# EAGLE design side_panel (EAGLE 9.7.0)
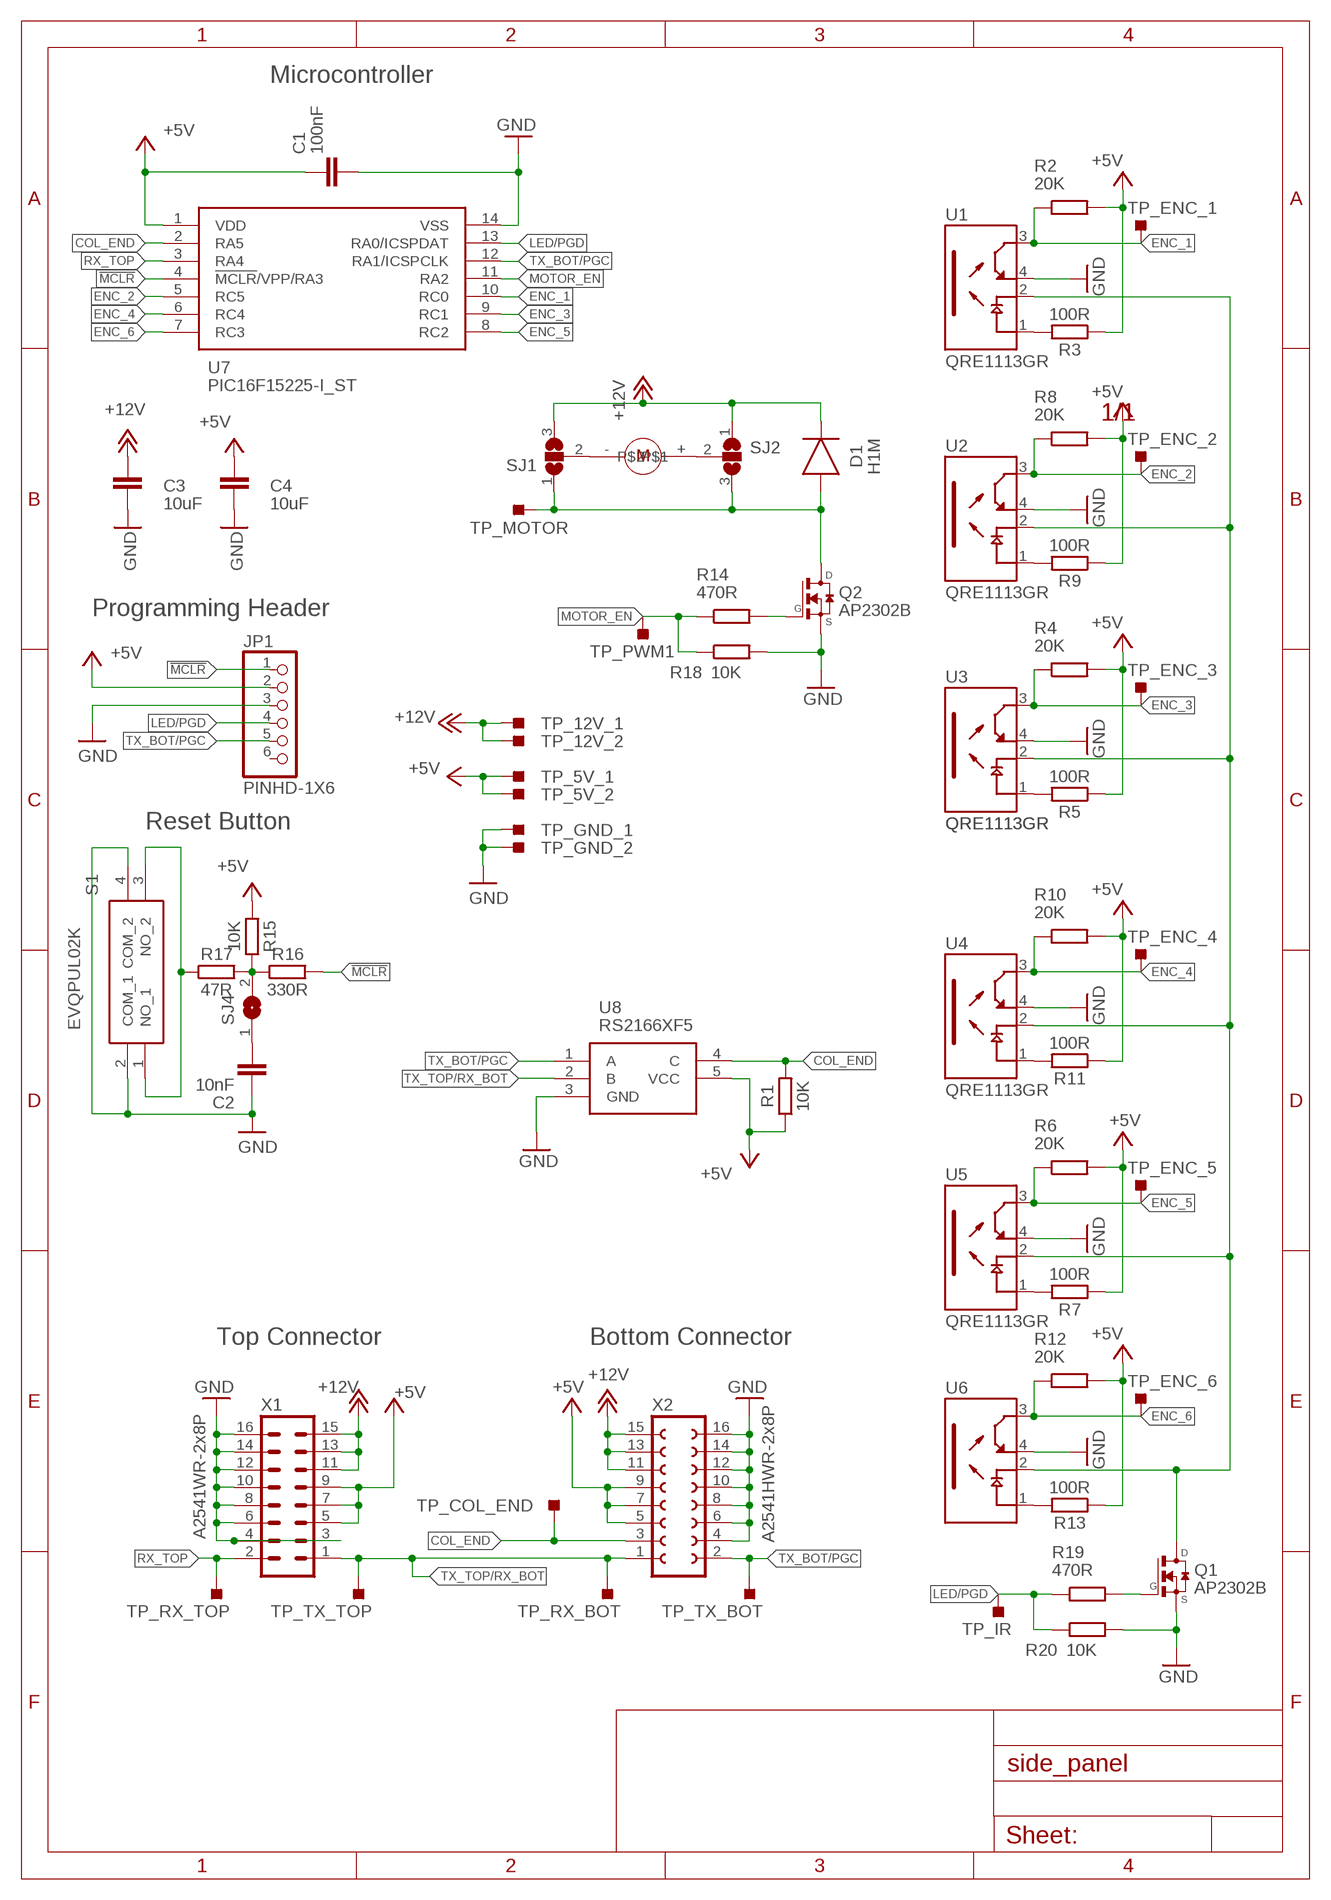
[diagram p0: schematic, sheet 1]

## Parts
C1  100nF  C_CHIP-0805(2012-METRIC)  [CAPC2012X110]
C2  10nF  C_CHIP-0805(2012-METRIC)  [CAPC2012X110]
C3  10uF  C-EUC0805  [C0805]
C4  10uF  C-EUC0805  [C0805]
D1  H1M  DIODE_DO-219-AB(SOD123F)  [SODFL3718X115]
JP1  PINHD-1X6  [1X06]
M1  GA12-N20  [GA12-N20]
Q1  AP2302B  TRANSISTOR-FET_DMN2004K  [TRANSISTOR-FET_SOT23]
Q2  AP2302B  TRANSISTOR-FET_DMN2004K  [TRANSISTOR-FET_SOT23]
R1  10K  R_CHIP-0805(2012-METRIC)  [RESC2012X65]
R2  20K  R_CHIP-0805(2012-METRIC)  [RESC2012X65]
R3  100R  R_CHIP-0805(2012-METRIC)  [RESC2012X65]
R4  20K  R_CHIP-0805(2012-METRIC)  [RESC2012X65]
R5  100R  R_CHIP-0805(2012-METRIC)  [RESC2012X65]
R6  20K  R_CHIP-0805(2012-METRIC)  [RESC2012X65]
R7  100R  R_CHIP-0805(2012-METRIC)  [RESC2012X65]
R8  20K  R_CHIP-0805(2012-METRIC)  [RESC2012X65]
R9  100R  R_CHIP-0805(2012-METRIC)  [RESC2012X65]
R10  20K  R_CHIP-0805(2012-METRIC)  [RESC2012X65]
R11  100R  R_CHIP-0805(2012-METRIC)  [RESC2012X65]
R12  20K  R_CHIP-0805(2012-METRIC)  [RESC2012X65]
R13  100R  R_CHIP-0805(2012-METRIC)  [RESC2012X65]
R14  470R  R_CHIP-0805(2012-METRIC)  [RESC2012X65]
R15  10K  R_CHIP-0805(2012-METRIC)  [RESC2012X65]
R16  330R  R_CHIP-0805(2012-METRIC)  [RESC2012X65]
R17  47R  R_CHIP-0805(2012-METRIC)  [RESC2012X65]
R18  10K  R_CHIP-0805(2012-METRIC)  [RESC2012X65]
R19  470R  R_CHIP-0805(2012-METRIC)  [RESC2012X65]
R20  10K  R_CHIP-0805(2012-METRIC)  [RESC2012X65]
S1  EVQPUL02K  [EVQPUL02K]
SJ1  SJ2W  [SJ_2]
SJ2  SJ2W  [SJ_2]
SJ4  SJ  [SJ]
TP_5V_1  TESTPOINT_TPS-PAD-036  [TESTPOINT_PAD-036]
TP_5V_2  TESTPOINT_TPS-PAD-036  [TESTPOINT_PAD-036]
TP_12V_1  TESTPOINT_TPS-PAD-036  [TESTPOINT_PAD-036]
TP_12V_2  TESTPOINT_TPS-PAD-036  [TESTPOINT_PAD-036]
TP_COL_END  TESTPOINT_TPS-PAD-036  [TESTPOINT_PAD-036]
TP_ENC_1  TESTPOINT_TPS-PAD-036  [TESTPOINT_PAD-036]
TP_ENC_2  TESTPOINT_TPS-PAD-036  [TESTPOINT_PAD-036]
TP_ENC_3  TESTPOINT_TPS-PAD-036  [TESTPOINT_PAD-036]
TP_ENC_4  TESTPOINT_TPS-PAD-036  [TESTPOINT_PAD-036]
TP_ENC_5  TESTPOINT_TPS-PAD-036  [TESTPOINT_PAD-036]
TP_ENC_6  TESTPOINT_TPS-PAD-036  [TESTPOINT_PAD-036]
TP_GND_1  TESTPOINT_TPS-PAD-036  [TESTPOINT_PAD-036]
TP_GND_2  TESTPOINT_TPS-PAD-036  [TESTPOINT_PAD-036]
TP_IR  TESTPOINT_TPS-PAD-036  [TESTPOINT_PAD-036]
TP_MOTOR  TESTPOINT_TPS-PAD-036  [TESTPOINT_PAD-036]
TP_PWM1  TESTPOINT_TPS-PAD-036  [TESTPOINT_PAD-036]
TP_RX_BOT  TESTPOINT_TPS-PAD-036  [TESTPOINT_PAD-036]
TP_RX_TOP  TESTPOINT_TPS-PAD-036  [TESTPOINT_PAD-036]
TP_TX_BOT  TESTPOINT_TPS-PAD-036  [TESTPOINT_PAD-036]
TP_TX_TOP  TESTPOINT_TPS-PAD-036  [TESTPOINT_PAD-036]
U1  QRE1113GR  [SOIC180P460X187-4N]
U2  QRE1113GR  [SOIC180P460X187-4N]
U3  QRE1113GR  [SOIC180P460X187-4N]
U4  QRE1113GR  [SOIC180P460X187-4N]
U5  QRE1113GR  [SOIC180P460X187-4N]
U6  QRE1113GR  [SOIC180P460X187-4N]
U7  PIC16F15225-I_ST  [SOP65P640X120-14N]
U8  RS2166XF5  SN74LVC1G66DBVR  [SOT95P280X145-5N]
X1  A2541WR-2x8P  MA08-2W  [MA08-2W]
X2  A2541HWR-2x8P  FE08-2W  [FE08-2W]

## Nets
!MCLR: JP1.1 R16.2 U7.4(!MCLR!/VPP/RA3)
+5V: C1.1 C4.1 JP1.2 R1.1 R2.2 R3.1 R4.2 R5.1 R6.2 R7.1 R8.2 R9.1 R10.2 R11.1 R12.2 R13.1 R15.1 TP_5V_1.1(TP) TP_5V_2.1(TP) U7.1(VDD) U8.5(VCC) X1.5 X1.7 X1.9 X2.5 X2.7 X2.9
+12V: C3.1 D1.1(C) SJ1.3 SJ2.1 TP_12V_1.1(TP) TP_12V_2.1(TP) X1.11 X1.13 X1.15 X2.11 X2.13 X2.15
COL_END: R1.2 TP_COL_END.1(TP) U7.2(RA5) U8.4(C) X2.3
ENC_1: R2.1 TP_ENC_1.1(TP) U1.3(CT) U7.10(RC0)
ENC_2: R8.1 TP_ENC_2.1(TP) U2.3(CT) U7.5(RC5)
ENC_3: R4.1 TP_ENC_3.1(TP) U3.3(CT) U7.9(RC1)
ENC_4: R10.1 TP_ENC_4.1(TP) U4.3(CT) U7.6(RC4)
ENC_5: R6.1 TP_ENC_5.1(TP) U5.3(CT) U7.8(RC2)
ENC_6: R12.1 TP_ENC_6.1(TP) U6.3(CT) U7.7(RC3)
GND: C1.2 C2.1 C3.2 C4.2 JP1.3 Q1.2(S) Q2.2(S) R18.2 R20.2 S1.2(COM_1) S1.4(COM_2) TP_GND_1.1(TP) TP_GND_2.1(TP) U1.4(ET) U2.4(ET) U3.4(ET) U4.4(ET) U5.4(ET) U6.4(ET) U7.14(VSS) U8.3(GND) X1.3 X1.4 X1.6 X1.8 X1.10 X1.12 X1.14 X1.16 X2.4 X2.6 X2.8 X2.10 X2.12 X2.14 X2.16
LED/PGD: JP1.4 R19.1 R20.1 TP_IR.1(TP) U7.13(RA0/ICSPDAT)
MOTOR_EN: R14.1 R18.1 TP_PWM1.1(TP) U7.11(RA2)
N$1: M1.- SJ1.2
N$2: M1.+ SJ2.2
N$3: D1.2(A) Q2.3(D) SJ1.1 SJ2.3 TP_MOTOR.1(TP)
N$4: R3.2 U1.1(A)
N$5: Q2.1(G) R14.2
N$6: R5.2 U3.1(A)
N$8: Q1.3(D) U1.2(C) U2.2(C) U3.2(C) U4.2(C) U5.2(C) U6.2(C)
N$9: R7.2 U5.1(A)
N$10: Q1.1(G) R19.2
N$11: R9.2 U2.1(A)
N$13: R11.2 U4.1(A)
N$15: R13.2 U6.1(A)
N$20: C2.2 SJ4.1
N$21: R15.2 R16.1 R17.2 SJ4.2
N$22: R17.1 S1.1(NO_1) S1.3(NO_2)
RX_TOP: TP_RX_TOP.1(TP) U7.3(RA4) X1.2
TX_BOT/PGC: JP1.5 TP_TX_BOT.1(TP) U7.12(RA1/ICSPCLK) U8.1(A) X2.2
TX_TOP/RX_BOT: TP_RX_BOT.1(TP) TP_TX_TOP.1(TP) U8.2(B) X1.1 X2.1
Unconnected: JP1.6

## Notes on the sheet
- Microcontroller
- Programming Header
- Reset Button
- Top Connector | Bottom Connector

## Library data of the parts
C1 C2 = Capacitor:C: Capacitor - Generic; CATEGORY: Capacitor
C3 C4 = rcl:C-EU: CAPACITOR, European symbol; SPICEPREFIX: C
D1 = Diode:DIODE: Diode Rectifier - Generic; CATEGORY: Diode; SUB-CATEGORY: Rectifier; VALUE: DIODE
JP1 = Connector:PINHD-1X6: PIN HEADER; CATEGORY: CONNECTOR; SUB-CATEGORY: PIN-HEADER
M1 = GA12-N20:GA12-N20
Q1 Q2 = 52101-101-REV-A_v16:TRANSISTOR-FET_DMN2004K: N-Channel Enhancement MOSFET
R1-R20 = Resistor:R: Resistor Fixed - Generic; CATEGORY: Resistor; SUB-CATEGORY: Fixed
S1 = SamacSys_Parts:EVQPUL02K: Black Tactile Switch, Single Pole Single Throw (SPST) 50 mA @ 12 V ac 1.65mm Source: Datasheet <https://www3.panasonic.biz/ac/e_download/control/switch/light-touch/catalog/sw_lt_eng_smalls_side.pdf?f_cd=402910&via=ok>; DESCRIPTION: Black Tactile Switch, Single Pole Single Throw (SPST) 50 mA @ 12 V ac 1.65mm; HEIGHT: 1.95mm; MANUFACTURER_NAME: Panasonic; MANUFACTURER_PART_NUMBER: EVQPUL02K
SJ1 SJ2 = jumper:SJ2W: SMD solder JUMPER
SJ4 = jumper:SJ: SMD solder JUMPER
TP_5V_1 TP_5V_2 TP_12V_1 TP_12V_2 TP_COL_END TP_ENC_1-TP_ENC_6 TP_GND_1 TP_GND_2 TP_IR TP_MOTOR TP_PWM1 TP_RX_BOT TP_RX_TOP TP_TX_BOT TP_TX_TOP = 52101-101-REV-A_v16:TESTPOINT_TPS: TEST POINT PAD; BOM: EXCLUDE
U1-U6 = QRE11113-lib:QRE1113GR: QRE1113 Series 30 V 50 mA Miniature Reflective Object Sensor - SMD-4 Check prices <https://pricing.snapeda.com/parts/QRE1113GR/ON/view-part?ref=eda>; AVAILABILITY: In Stock; DESCRIPTION: Reflective Optical Sensor 0.039 (1mm) 4-SMD, Gull Wing; MF: ON; MP: QRE1113GR; PACKAGE: ARUSM-313-4 ON Semiconductor; PRICE: None; PURCHASE-URL: https://pricing.snapeda.com/search/part/QRE1113GR/?ref=eda
U7 = SamacSys_Parts:PIC16F15225-I_ST: IC MCU 8BIT 14KB FLASH 14TSSOP Source: Datasheet <https://ww1.microchip.com/downloads/en/DeviceDoc/PIC16F1522545_Full_Featured_1420-Pin_Microcontrollers_Data_Sheet_20006389B.pdf>; DESCRIPTION: IC MCU 8BIT 14KB FLASH 14TSSOP; HEIGHT: 1.2mm; MANUFACTURER_NAME: Microchip; MANUFACTURER_PART_NUMBER: PIC16F15225-I/ST; MOUSER_PART_NUMBER: 579-PIC16F15225-I/ST; MOUSER_PRICE-STOCK: https://www.mouser.co.uk/ProductDetail/Microchip-Technology/PIC16F15225-I-ST?qs=W%2FMpXkg%252BdQ7tfFv1ssp4Pw%3D%3D
U8 = SamacSys_Parts:SN74LVC1G66DBVR: SINGLE BILATERAL ANALOG SWITCH Source: Datasheet <http://www.ti.com/lit/gpn/sn74lvc1g66>; ARROW_PART_NUMBER: SN74LVC1G66DBVR; ARROW_PRICE-STOCK: https://www.arrow.com/en/products/sn74lvc1g66dbvr/texas-instruments; DESCRIPTION: SINGLE BILATERAL ANALOG SWITCH; HEIGHT: 1.45mm; MANUFACTURER_NAME: Texas Instruments; MANUFACTURER_PART_NUMBER: SN74LVC1G66DBVR; MOUSER_PART_NUMBER: 595-SN74LVC1G66DBVR; MOUSER_PRICE-STOCK: https://www.mouser.co.uk/ProductDetail/Texas-Instruments/SN74LVC1G66DBVR?qs=pt%2FIv5r0EPcNpRLTEQzKFQ%3D%3D
X1 = con-lstb:MA08-2W: PIN HEADER; OC_FARNELL: unknown; OC_NEWARK: unknown
X2 = con-lsta:FE08-2W: FEMALE HEADER; OC_FARNELL: unknown; OC_NEWARK: unknown

## Board
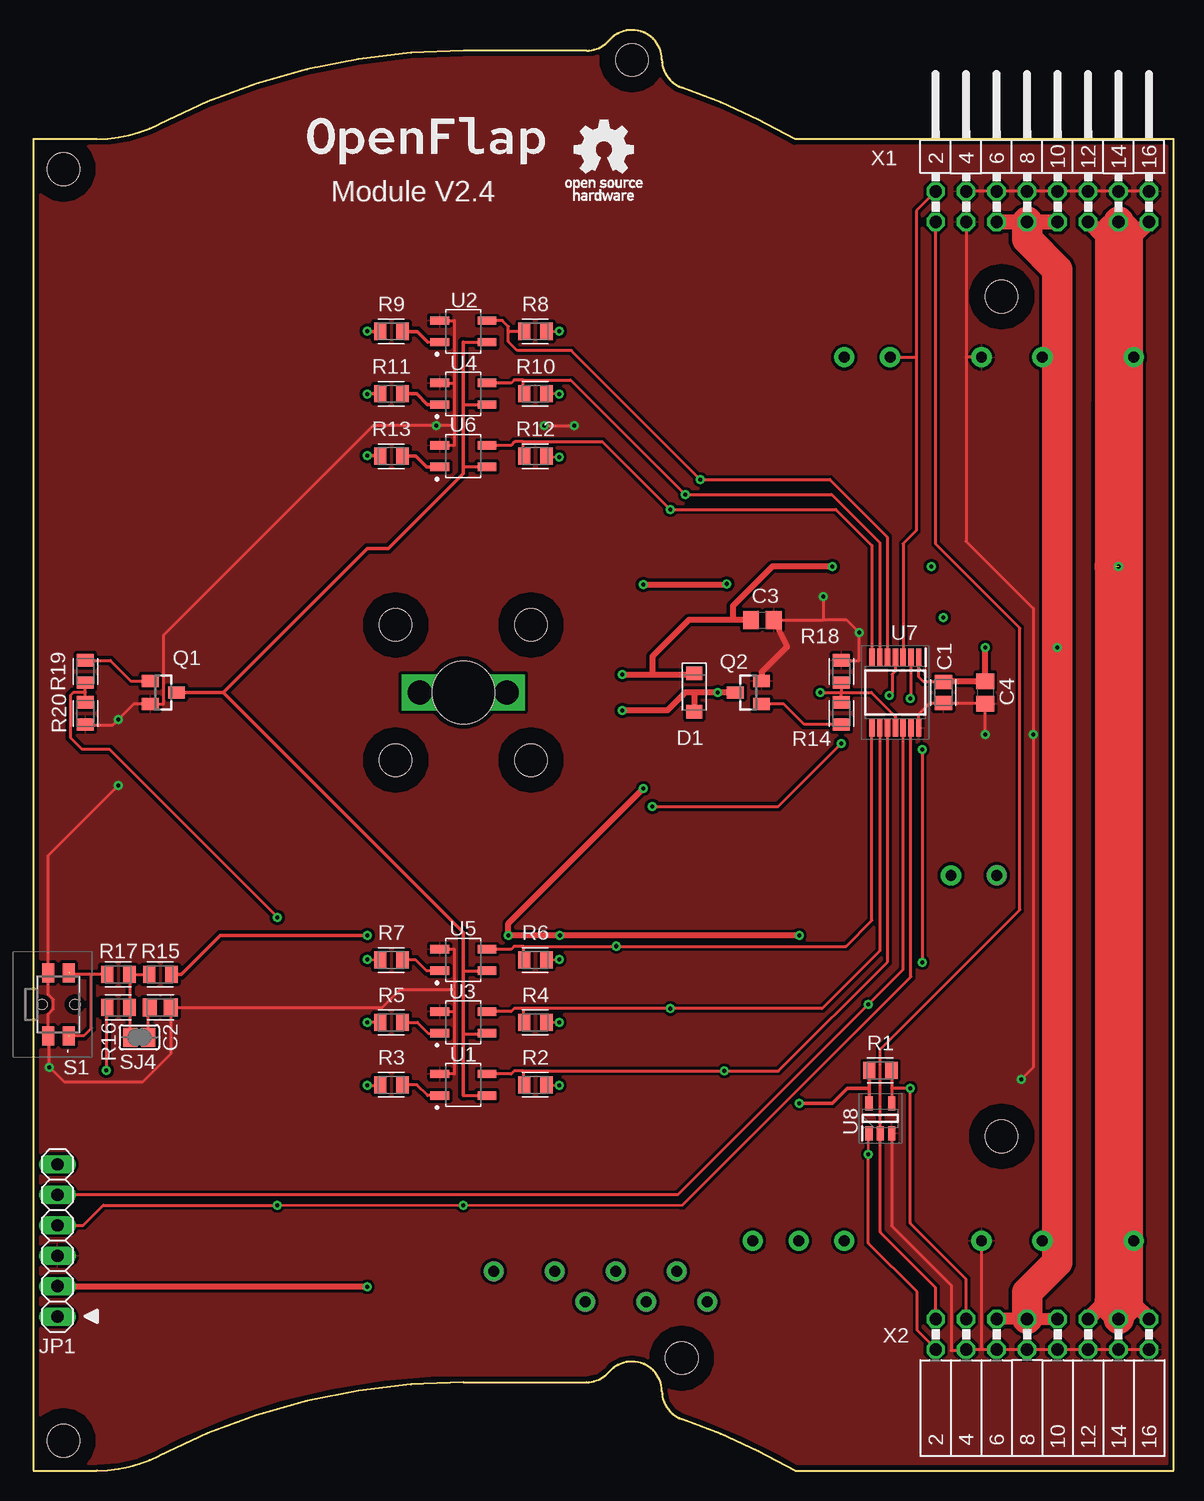
[diagram p1: board, top side]
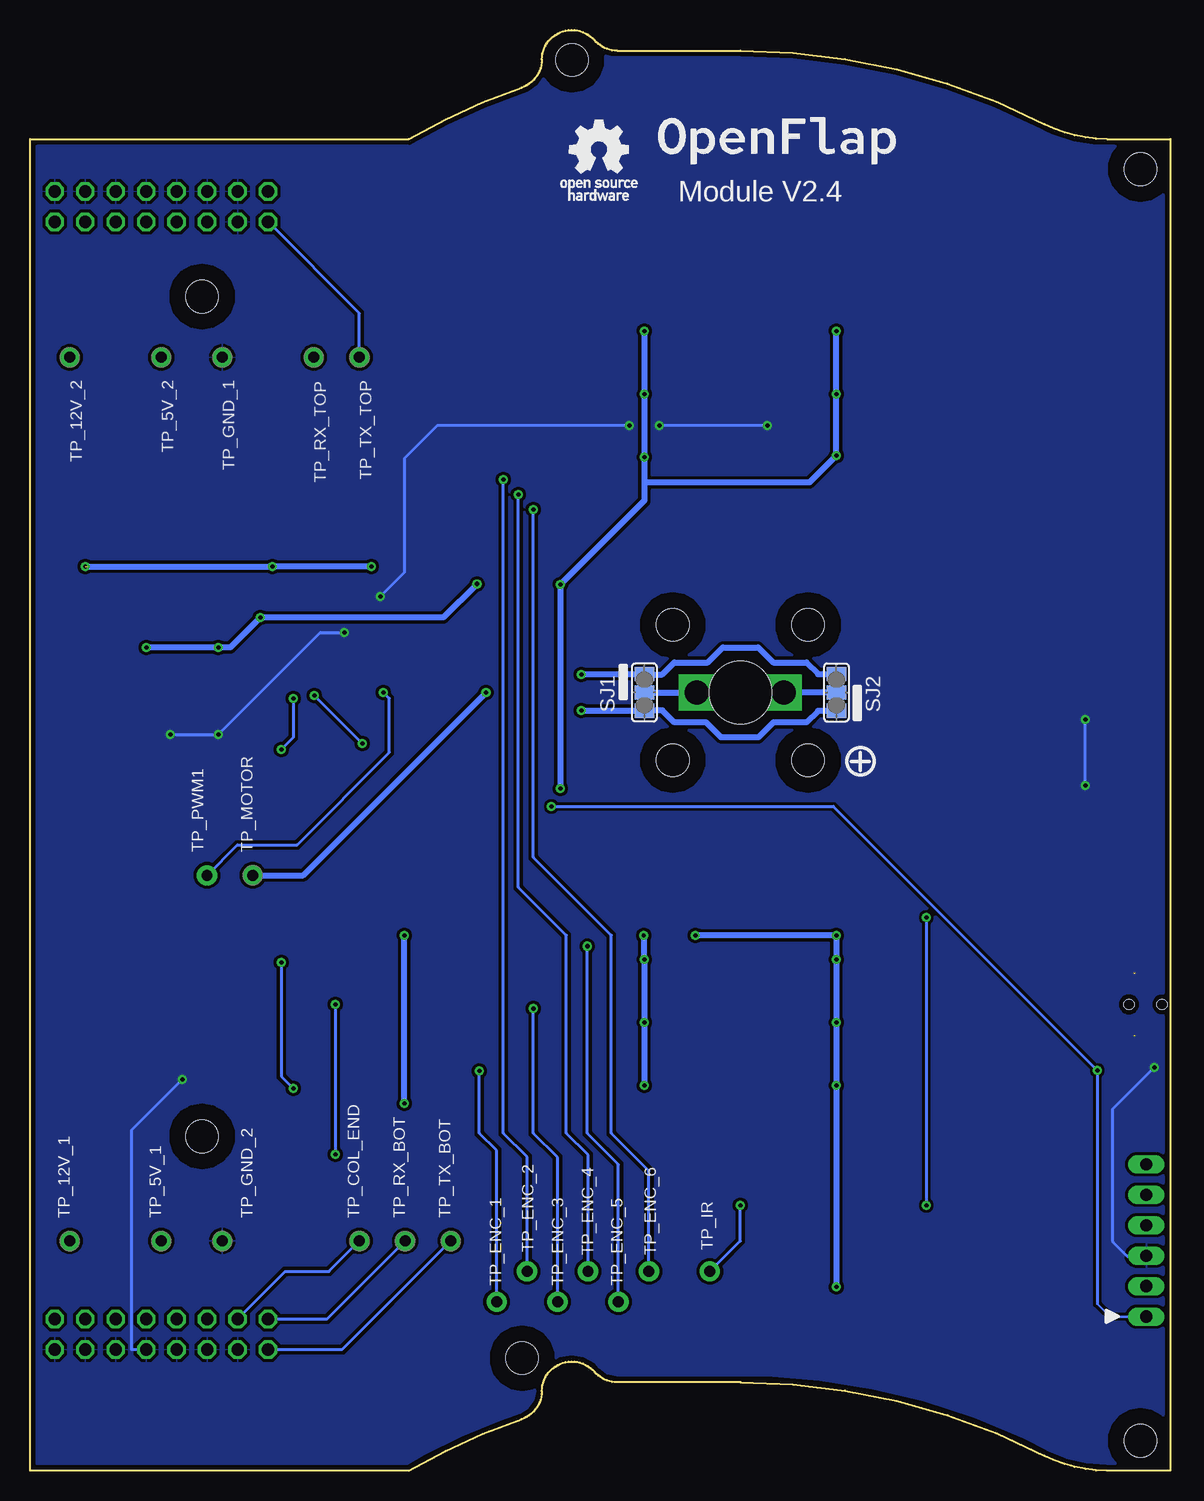
[diagram p2: board, bottom side, seen from below]

Size 95.03 x 120.1 mm. Coordinates in mm from the lower left corner, seen from the top.
Outline: 35.83,7.37 46.09,7.37 arc49 47.98,8.24 arc-138 52.37,6.63 arc70 54.05,4.3 arc-11 63.47,0 95.03,0 95.03,111 63.47,111 arc11 54.05,115.3 arc-70 52.37,117.63 arc138 47.98,119.24 arc-49 46.09,118.37 35.83,118.37 arc27 10.5,112.26 arc-27 5.28,111 0,111 0,0 5.28,0 arc27 10.5,1.26 arc-27 35.83,7.37
Copper layers (1*16): Top / Bottom
Stack-up Default Layer Stack: Top User Defined 0.035mm / Dielectric-1 User Defined 1.5mm / Bottom User Defined 0.035mm
Design rules "default *": minimum track width 6mil, minimum drill 0.35mm, track to track 6mil, track to pad 6mil, pad to pad 6mil, via to via 6mil, smd to smd 6mil, copper to edge 0.4mm, drill to drill 6mil, minimum pad ring 10mil, minimum via ring 8mil, stop-mask expansion 4mil, vias tented up to drill 0mil, thermal gap 10mil
Holes 2.7 mm at 80.69,97.87 49.87,117.6 2.5,2.5 54.02,9.39 80.69,27.87 2.5,108.5 41.46,70.51 30.19,70.51 30.19,59.24 41.46,59.24
tKeepout: area 20.3,49.4 to 51.3,80.4; area -19.7,7.4 to 91.3,118.4
tRestrict: area 1,1 to 4,4; area 52.6,7.9 to 55.5,10.8; area 79.2,26.4 to 82.1,29.3; area 79.2,96.4 to 82.1,99.3; area 28.7,69.1 to 31.6,72; area 40,69.1 to 42.9,72; area 28.7,57.8 to 31.6,60.7; area 40,57.8 to 42.9,60.7; area 1,107 to 4,110; area 48.4,116.1 to 51.3,119.1
bRestrict: area 1,1 to 4,4; area 52.6,7.9 to 55.5,10.8; area 79.2,26.4 to 82.1,29.3; area 79.2,96.4 to 82.1,99.3; area 28.7,69.1 to 31.6,72; area 40,69.1 to 42.9,72; area 28.7,57.8 to 31.6,60.7; area 40,57.8 to 42.9,60.7; area 1,107 to 4,110; area 48.4,116.1 to 51.3,119.1

### Footprints (pad centres in the part's own frame; a part is rotated, then mirrored left to right if it is on the bottom)
CAPC2012X110 = smd 1.165 x 1.465: 1 -0.875,0; 2 0.875,0
C0805 = smd 1.3 x 1.5: 1 -0.95,0; 2 0.95,0
SODFL3718X115 = smd 1.115 x 1.361: 1 -1.6,0; 2 1.6,0
1X06 = drill 1.016 long: 1 -6.35,0; 2 -3.81,0; 3 -1.27,0; 4 1.27,0; 5 3.81,0; 6 6.35,0
GA12-N20 = drill 2 square: + -3.625,0; - 3.625,0 | hole 5.2: 0,0
TRANSISTOR-FET_SOT23 = smd 1 x 1.4: 1 -0.95,-1.1; 2 0.95,-1.1; 3 0,1.1
RESC2012X65 = smd 1.031 x 1.42: 1 -0.919,0; 2 0.919,0
EVQPUL02K = smd 1.55 x 1: 1 2.625,0.85; 2 2.625,-0.85; 3 -2.625,0.85; 4 -2.625,-0.85 | hole 0.85: 0,-1.375; 0,1.375
SJ_2 = smd 1.168 x 1.6: 1 -1.524,0; 2 0,0; 3 1.524,0
SJ = smd 1.168 x 1.6: 1 -0.762,0; 2 0.762,0
TESTPOINT_PAD-036 = drill 0.914 pad 1.676: 1 0,0
SOIC180P460X187-4N = smd 0.69 x 1.57: 1 -0.9,1.975; 2 -0.9,-1.975; 3 0.9,-1.975; 4 0.9,1.975
SOP65P640X120-14N = smd 1.475 x 0.45: 1 -2.938,1.95; 2 -2.938,1.3; 3 -2.938,0.65; 4 -2.938,0; 5 -2.938,-0.65; 6 -2.938,-1.3; 7 -2.938,-1.95; 8 2.938,-1.95; 9 2.938,-1.3; 10 2.938,-0.65; 11 2.938,0; 12 2.938,0.65; 13 2.938,1.3; 14 2.938,1.95
SOT95P280X145-5N = smd 1.2 x 0.6: 1 -1.25,0.95; 2 -1.25,0; 3 -1.25,-0.95; 4 1.25,-0.95; 5 1.25,0.95
MA08-2W = drill 1.016 octagon: 1 -8.89,-1.27; 2 -8.89,1.27; 3 -6.35,-1.27; 4 -6.35,1.27; 5 -3.81,-1.27; 6 -3.81,1.27; 7 -1.27,-1.27; 8 -1.27,1.27; 9 1.27,-1.27; 10 1.27,1.27; 11 3.81,-1.27; 12 3.81,1.27; 13 6.35,-1.27; 14 6.35,1.27; 15 8.89,-1.27; 16 8.89,1.27
FE08-2W = drill 1.016 octagon: 1 -8.89,1.27; 2 -8.89,-1.27; 3 -6.35,1.27; 4 -6.35,-1.27; 5 -3.81,1.27; 6 -3.81,-1.27; 7 -1.27,1.27; 8 -1.27,-1.27; 9 1.27,1.27; 10 1.27,-1.27; 11 3.81,1.27; 12 3.81,-1.27; 13 6.35,1.27; 14 6.35,-1.27; 15 8.89,1.27; 16 8.89,-1.27

### Placement (x,y rotation side)
C1  75.83,64.87 270 top
C2  10.58,38.62 180 top
C3  60.75,70.92 0 top
C4  79.33,64.87 270 top
D1  55.07,64.87 270 top
JP1  2,19.19 90 top
M1  35.83,64.87 0 top
Q1  10.83,64.87 270 top
Q2  59.58,64.87 90 top
R1  70.58,33.37 0 top
R2  41.83,32.17 0 top
R3  29.83,32.17 0 top
R4  41.83,37.37 0 top
R5  29.83,37.37 0 top
R6  41.83,42.57 0 top
R7  29.83,42.57 0 top
R8  41.83,94.97 0 top
R9  29.83,94.97 0 top
R10  41.83,89.77 0 top
R11  29.83,89.77 0 top
R12  41.83,84.57 0 top
R13  29.83,84.57 0 top
R14  67.33,63.12 270 top
R15  10.58,41.37 180 top
R16  7.08,38.62 180 top
R17  7.08,41.37 0 top
R18  67.33,66.62 90 top
R19  4.33,66.62 90 top
R20  4.33,63.12 270 top
S1  2.08,38.87 270 top
SJ1  43.83,64.87 90 bottom
SJ2  27.83,64.87 270 bottom
SJ4  8.83,36.12 180 top
TP_5V_1  84.09,19.15 90 bottom
TP_5V_2  84.09,92.81 270 bottom
TP_12V_1  91.71,19.15 90 bottom
TP_12V_2  91.71,92.81 270 bottom
TP_COL_END  67.58,19.15 90 bottom
TP_ENC_1  56.15,14.07 90 top
TP_ENC_2  53.61,16.61 90 top
TP_ENC_3  51.07,14.07 90 top
TP_ENC_4  48.53,16.61 90 top
TP_ENC_5  45.99,14.07 90 top
TP_ENC_6  43.45,16.61 90 top
TP_GND_1  79.01,92.81 270 bottom
TP_GND_2  79.01,19.15 90 bottom
TP_IR  38.37,16.61 90 top
TP_MOTOR  76.47,49.63 90 bottom
TP_PWM1  80.28,49.63 90 top
TP_RX_BOT  63.77,19.15 180 bottom
TP_RX_TOP  71.39,92.81 270 bottom
TP_TX_BOT  59.96,19.15 0 bottom
TP_TX_TOP  67.58,92.81 270 bottom
U1  35.83,32.17 90 top
U2  35.83,94.97 90 top
U3  35.83,37.37 90 top
U4  35.83,89.77 90 top
U5  35.83,42.57 90 top
U6  35.83,84.57 90 top
U7  71.83,64.87 270 top
U8  70.58,29.37 90 top
X1  84.08,105.37 0 top
X2  84.08,11.37 0 top

### Tracks (layer width: path | path; a pad name or v marks a point on that pad's centre or on a via)
!MCLR  (via drill 0.35)
  Top 0.2: R16.2 6.08,38.54
  Top 0.254: 6.08,38.54 v6.08,33.37 | v71.33,64.62 71.56,64.86 71.56,66.38 71.83,66.64 U7.4 | v51.58,55.37 62.08,55.37 v67.33,60.62
  Bottom 0.2: 6.08,13.92 5,12.84 JP1.1
  Bottom 0.254: v71.33,64.62 v67.33,60.62 | 6.08,13.92 v6.08,33.37 28.08,55.37 v51.58,55.37
+5V  (via drill 0.35)
  Top 0.152: U8.5 69.66,30.66
  Top 0.2: R6.2 43.78,42.57 v43.83,42.62 | v43.83,37.37 R4.2 | v43.83,32.12 42.8,32.12 R2.2 | 28.86,32.12 R3.1 | R7.1 27.88,42.57 v27.83,42.62 | 27.85,94.97 v27.83,95 | 28.86,84.62 R13.1 | 27.85,89.77 v27.83,89.75 | R8.2 43.8,94.97 v43.83,95 | v43.83,84.5 42.82,84.5 R12.2 | R10.2 43.8,89.77 v43.83,89.75 | 82.81,15.1 X2.7
  Top 0.254: C1.1 74.2,65.75 73.78,66.17 U7.1 | v27.83,32.12 28.86,32.12 | R5.1 v27.83,37.37 | TP_5V_1.1 85.33,19.15 | TP_5V_2.1 85.33,92.81
  Top 0.305: R15.1 12.33,41.37 15.58,44.62 v27.83,44.62 | v63.83,30.62 66.58,30.62 67.83,31.87 69.66,31.87 | R9.1 27.85,94.97 | v27.83,84.62 28.86,84.62 | R11.1 27.85,89.77 | 69.66,31.87 R1.1 | 69.66,31.87 69.66,30.66
  Top 0.5: v79.33,68.62 C4.1 79.33,65.77 75.85,65.77 C1.1
  Top 0.508: v50.83,56.87 39.58,45.62 v39.58,44.62 v43.88,44.62 v63.83,44.62 | v27.83,15.32 2,15.32 JP1.2 | v50.83,73.87 57.72,73.87 v57.77,73.93
  Top 1.016: X2.5 X2.7 X2.9
  Top 1.27: X1.5 X1.7 X1.9
  Top 2.54: X2.7 82.81,14.85 85.33,17.37 85.33,19.15 v85.33,68.62 85.33,92.81 85.33,100.12 82.81,102.64 X1.7
  Bottom 0.2: v43.83,95 43.83,94.87 43.7,95
  Bottom 0.254: 43.83,44.57 v43.88,44.62
  Bottom 0.508: v39.58,44.62 v27.83,44.62 v27.83,42.62 v27.83,37.37 v27.83,32.12 v27.83,15.32 | v27.83,95 v27.83,89.75 v27.83,84.62 30.08,82.37 43.83,82.37 | 43.83,94.87 v43.83,89.75 v43.83,84.5 43.83,82.37 | v50.83,56.87 v50.83,73.87 43.83,80.87 43.83,82.37 | v85.33,68.62 v79.33,68.62 78.33,68.62 v75.83,71.12 60.58,71.12 v57.77,73.93 | v63.83,30.62 v63.83,44.62 | v43.83,32.12 v43.83,37.37 v43.83,42.62 43.83,44.57
+12V  (via drill 0.35)  (1 unrouted)
  Top 0.2: X2.13 90.58,12.64
  Top 0.254: TP_12V_1.1 90.43,19.15 90.43,14.07 | TP_12V_2.1 90.44,102.96
  Top 0.5: v49.08,66.37 51.58,66.37 | 51.58,66.37 54.97,66.37 D1.1 | 51.58,66.37 51.58,67.87 54.63,70.92 58.3,70.92 | C3.1 58.3,70.92 | v66.58,75.37 61.58,75.37 58.3,72.09 58.3,70.92
  Top 1.016: 90.58,12.64 89.31,13.91 89.16,13.91 | 91.7,13.91 X2.13 | 89.16,102.83 X1.13 91.7,102.83
  Top 1.27: 89.16,13.91 X2.11 | X2.15 91.7,13.91 | X1.11 89.16,102.83 | 91.7,102.83 X1.15
  Top 2.54: X1.13 90.44,102.96 | 90.43,14.07 X2.13
  Top 4: 90.44,102.96 v90.43,75.37 90.43,14.07
  Bottom 0.5: SJ2.1 29.35,66.4 30.33,67.37 33.11,67.37 34.36,68.62 37.29,68.62 38.54,67.37 41.33,67.37 42.33,66.37 43.8,66.37 SJ1.3 49.05,66.4 v49.08,66.37 | v66.58,75.37 v74.83,75.37 90.2,75.37
COL_END  (via drill 0.35)
  Top 0.2: R1.2 71.53,33.34 | 73.13,64.42 v73.08,64.37
  Top 0.254: 71.53,33.34 71.53,31.87 | 71.53,31.87 U8.4 | 71.53,31.87 v73.08,31.87 73.08,20.62 77.73,15.97 X2.3 | U7.2 73.13,64.42 | v74.08,60.12 v74.08,42.37
  Bottom 0.254: v73.08,64.37 73.08,61.12 v74.08,60.12 | v74.08,42.37 74.08,32.87 v73.08,31.87 | X2.3 73.76,16.61 70.12,16.61 TP_COL_END.1
ENC_1  (via drill 0.35)
  Top 0.2: R2.1 40.91,32.54 40.83,32.62
  Top 0.254: U1.3 39.8,33.07 40.05,33.32 40.83,33.32 | 40.83,33.32 40.83,32.62 | U7.10 71.18,42.42 62.08,33.32 v57.58,33.32 40.83,33.32
  Bottom 0.254: TP_ENC_1.1 56.15,26.69 57.58,28.12 v57.58,33.32
ENC_2  (via drill 0.35)
  Top 0.254: U7.5 71.17,77.83 66.38,82.62 v55.58,82.62 44.83,93.37 40.33,93.37 39.58,94.12 39.58,94.87 | 39.58,94.87 39.58,95.37 39.08,95.87 U2.3 | R8.1 39.68,94.97 39.58,94.87
  Bottom 0.254: TP_ENC_2.1 53.61,26.15 55.58,28.12 v55.58,82.62
ENC_3  (via drill 0.35)
  Top 0.2: R4.1 40.91,37.79 40.83,37.87
  Top 0.254: U3.3 39.8,38.27 40.05,38.52 40.83,38.52 | 40.83,38.52 40.83,37.87 | U7.9 70.53,43.32 65.73,38.52 v53.08,38.52 40.83,38.52
  Bottom 0.254: TP_ENC_3.1 51.07,26.11 53.08,28.12 v53.08,38.52
ENC_4  (via drill 0.35)
  Top 0.2: R10.1 40.83,89.85
  Top 0.254: U4.3 39.8,90.67 40.05,90.92 40.83,90.92 | 40.83,90.92 44.78,90.92 v54.33,81.37 66.53,81.37 70.53,77.37 U7.6 | 40.83,89.85 40.83,90.92
  Bottom 0.254: TP_ENC_4.1 48.53,26.32 50.33,28.12 50.33,44.62 54.33,48.62 v54.33,81.37
ENC_5  (via drill 0.35)
  Top 0.2: R6.1 40.91,43.04 40.83,43.12
  Top 0.254: U5.3 39.8,43.47 40.05,43.72 40.83,43.72 | 40.83,43.72 40.83,43.12 | U7.8 69.88,45.87 67.73,43.72 v48.58,43.72 40.83,43.72
  Bottom 0.254: TP_ENC_5.1 45.99,25.53 48.58,28.12 v48.58,43.72
ENC_6  (via drill 0.35)
  Top 0.2: R12.1 40.91,85.04 40.83,85.12
  Top 0.254: 40.83,85.79 40.11,85.79 39.8,85.47 U6.3 | 40.83,85.12 40.83,85.79 | U7.7 69.88,77.12 66.88,80.12 v53.08,80.12 47.41,85.79 40.83,85.79
  Bottom 0.254: TP_ENC_6.1 43.45,24.99 46.58,28.12 46.58,44.62 53.08,51.12 v53.08,80.12
GND  (via drill 0.35)
  Top 0.254: Q1.2 9.58,63.92 | 9.58,63.92 8.38,63.92 v7.08,62.62 6.58,62.12 4.41,62.12 R20.2 | U7.14 73.78,63.07 74.7,64 C1.2 75.85,63.97 79.28,63.97 C4.2 v79.33,61.37 | U8.3 71.53,20.42 76.48,15.47 76.48,10.02 77.65,10.02 X2.4 79.01,10.1 | 79.01,10.1 X2.6 X2.8 X2.10 X2.12 X2.14 X2.16 | v7.08,57.12 1.23,51.27 S1.4 1.23,39.7 1.65,39.27 1.65,38.48 1.23,38.05 S1.2 1.33,36.15 v1.33,33.62 1.34,33.64 2.61,32.37 9.08,32.37 11.45,34.75 C2.1 29.08,38.62 30.58,40.12 35.08,40.12 | U2.4 35.08,95.87 35.08,90.67 | 35.08,90.67 35.08,87.12 | 35.08,87.12 35.08,85.47 U6.4 | U4.4 35.08,90.67 | 35.08,87.12 v33.58,87.12 28.33,87.12 10.83,69.62 10.83,63.87 9.63,63.87 9.58,63.92 | U5.4 35.08,43.47 35.08,40.12 | 35.08,40.12 35.08,38.27 | 35.08,38.27 35.08,33.07 U1.4 | U3.4 35.08,38.27 | X1.16 X1.14 X1.12 X1.10 X1.8 X1.6 X1.4 X1.3 77.73,92.81 | 77.73,92.81 77.73,77.47 83.33,71.87 v83.33,61.37 83.33,33.62 v82.33,32.62 | C3.2 65.83,70.92 | 65.83,70.92 67.78,70.92 v68.83,69.87 68.83,67.54 R18.2 | v42.58,87.12 v45.08,87.12 | v65.83,72.87 65.83,70.92 | TP_GND_1.1 77.73,92.81 | TP_GND_2.1 79.01,10.1
  Top 0.5: Q2.2 60.68,66.57 62.8,68.7 C3.2
  Bottom 0.254: v1.33,33.62 4.83,30.12 4.83,19.12 3.58,17.87 2.05,17.87 JP1.3 | v7.08,57.12 v7.08,62.62 | v83.33,61.37 v79.33,61.37 70.83,69.87 v68.83,69.87 | v82.33,32.62 86.58,28.37 86.58,10.1 X2.10 | v33.58,87.12 v42.58,87.12 | v45.08,87.12 61.08,87.12 63.83,84.37 63.83,74.87 v65.83,72.87
  pour Top (isolate 0.254): -6.42,124.62 99.58,124.62 99.58,-6.88 -6.17,-6.88 -6.17,-6.63
  pour Bottom (isolate 0.254): -7.17,124.37 -7.17,-8.38 103.08,-8.38 103.08,124.12 76.58,124.12
LED/PGD  (via drill 0.35)
  Top 0.2: v20.33,22.12 v35.83,22.12 54.08,22.12 | v20.33,46.12 20.33,46.15
  Top 0.254: U7.13 73.13,41.17 54.08,22.12 | JP1.4 4.17,20.46 5.83,22.12 v20.33,22.12 | 20.33,46.15 6.36,60.12 4.08,60.12 3.08,61.12 3.08,64.62 3.33,64.87 4.33,64.87 | R20.1 4.33,64.87 | 4.33,64.87 R19.1
  Bottom 0.254: v20.33,46.12 v20.33,22.12 | TP_IR.1 35.83,19.15 v35.83,22.12
MOTOR_EN  (via drill 0.35)
  Top 0.254: U7.11 71.83,62.87 69.83,64.87 67.33,64.87 | R18.1 67.33,64.87 | R14.1 67.33,64.87 | v65.58,64.87 67.33,64.87
  Bottom 0.254: TP_PWM1.1 77.74,52.17 72.78,52.17 65.08,59.87 65.08,64.37 v65.58,64.87
N$1
  Bottom 0.5: SJ1.2 M1.-
N$2
  Bottom 0.5: SJ2.2 M1.+
N$3  (via drill 0.35)
  Top 0.5: v49.08,63.37 52.83,63.37 54.33,64.87 55.08,64.87 | D1.2 54.97,63.37 55.08,63.48 55.08,64.87 | Q2.3 v57.03,64.87 55.08,64.87
  Bottom 0.5: SJ2.3 29.35,63.35 30.33,62.37 33.08,62.37 34.33,61.12 37.42,61.12 38.67,62.37 41.33,62.37 42.33,63.37 43.8,63.37 SJ1.1 49.05,63.35 v49.08,63.37
  Bottom 0.508: TP_MOTOR.1 72.27,49.63 v57.03,64.87
N$4
  Top 0.254: R3.2 31.95,32.17 32.85,31.27 U1.1
N$5
  Top 0.254: R14.2 64.24,62.2 62.53,63.92 Q2.1
N$6
  Top 0.254: R5.2 32,37.37 32.9,36.47 U3.1
N$8
  Top 0.254: 35.83,31.27 U1.2 | U3.2 37.8,36.37 35.83,36.37 | U5.2 37.8,41.62 35.83,41.62 | 35.83,94.07 U2.2 | 35.83,88.87 U4.2 | U6.2 35.83,83.67
  Top 0.305: Q1.3 15.83,64.87 | 15.83,64.87 35.83,44.87 35.83,41.62 35.83,36.37 35.83,31.27 | 15.83,64.87 27.83,76.87 29.58,76.87 35.83,83.12 35.83,83.62 35.83,83.67 35.83,88.87 35.83,94.07
N$9
  Top 0.254: R7.2 31.88,42.57 32.78,41.67 U5.1
N$10
  Top 0.254: Q1.1 8.13,65.82 6.41,67.54 R19.2
N$11
  Top 0.2: 32.88,94.07 U2.1
  Top 0.305: R9.2 31.98,94.97 32.88,94.07
N$13
  Top 0.305: U4.1 32.83,88.87 31.93,89.77 R11.2
N$15
  Top 0.305: U6.1 32.78,83.67 31.88,84.57 R13.2
N$20
  Top 0.2: 9.59,38.51 C2.2
  Top 0.254: SJ4.1 9.59,38.51
N$21
  Top 0.2: R17.2 8.08,41.37 | 8.08,38.71 R16.1 8.06,38.56
  Top 0.254: R15.2 8.08,41.37 8.08,38.71 | SJ4.2 8.06,38.56
N$22  (2 unrouted)
  Top 0.2: 3.17,41.37 3.04,41.5 | 3.17,36.37 3.04,36.25
  Top 0.254: R17.1 4.83,41.37 | 4.83,41.37 4.83,36.87 4.2,36.25 S1.1 | 4.83,41.37 3.05,41.37 S1.3
RX_TOP
  Top 0.254: X1.2 73.58,105.03 73.58,92.81 | 73.58,92.81 73.58,78.37 72.48,77.27 U7.3 | TP_RX_TOP.1 73.58,92.81
TX_BOT/PGC  (via drill 0.35)
  Top 0.2: U8.1 69.58,28.07 v69.58,26.37
  Top 0.254: JP1.5 53.71,23 v69.58,38.87 72.48,41.77 U7.12 | v69.58,26.37 69.58,18.96 73.64,14.9 73.64,11.71 75.19,10.17 X2.2
  Bottom 0.254: v69.58,38.87 v69.58,26.37 | X2.2 69.01,10.1 TP_TX_BOT.1
TX_TOP/RX_BOT
  Top 0.254: X2.1 75.19,15.26 70.58,19.87 U8.2 70.58,35.12 82.21,46.75 82.21,70.24 75.19,77.26 X1.1
  Bottom 0.254: X2.1 70.28,12.64 TP_RX_BOT.1 | TP_TX_TOP.1 67.58,96.49 X1.1

### Text on the board
tPlace: Module V2.4
bPlace: Module V2.4